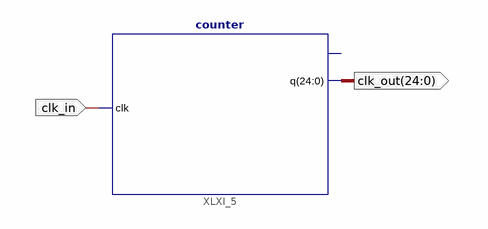
[diagram p0: schematic sheet 1]
// Xilinx ISE schematic Blinker.sch (spartan3e) as structural Verilog: 1 symbols, 2 ports
module Blinker (
  input  clk_in,
  output [24:0] clk_out
);

  counter XLXI_5 (.clk(clk_in), .q(clk_out));  // open: thresh0
endmodule
